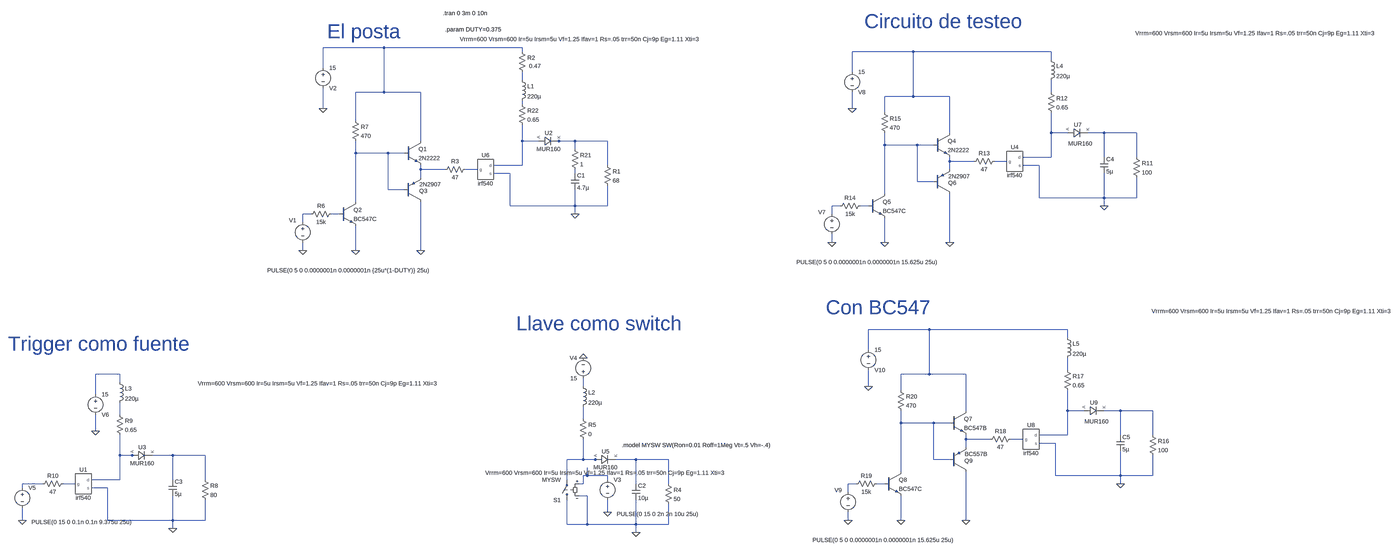
[diagram p0: schematic boostSch.asc, whole sheet]
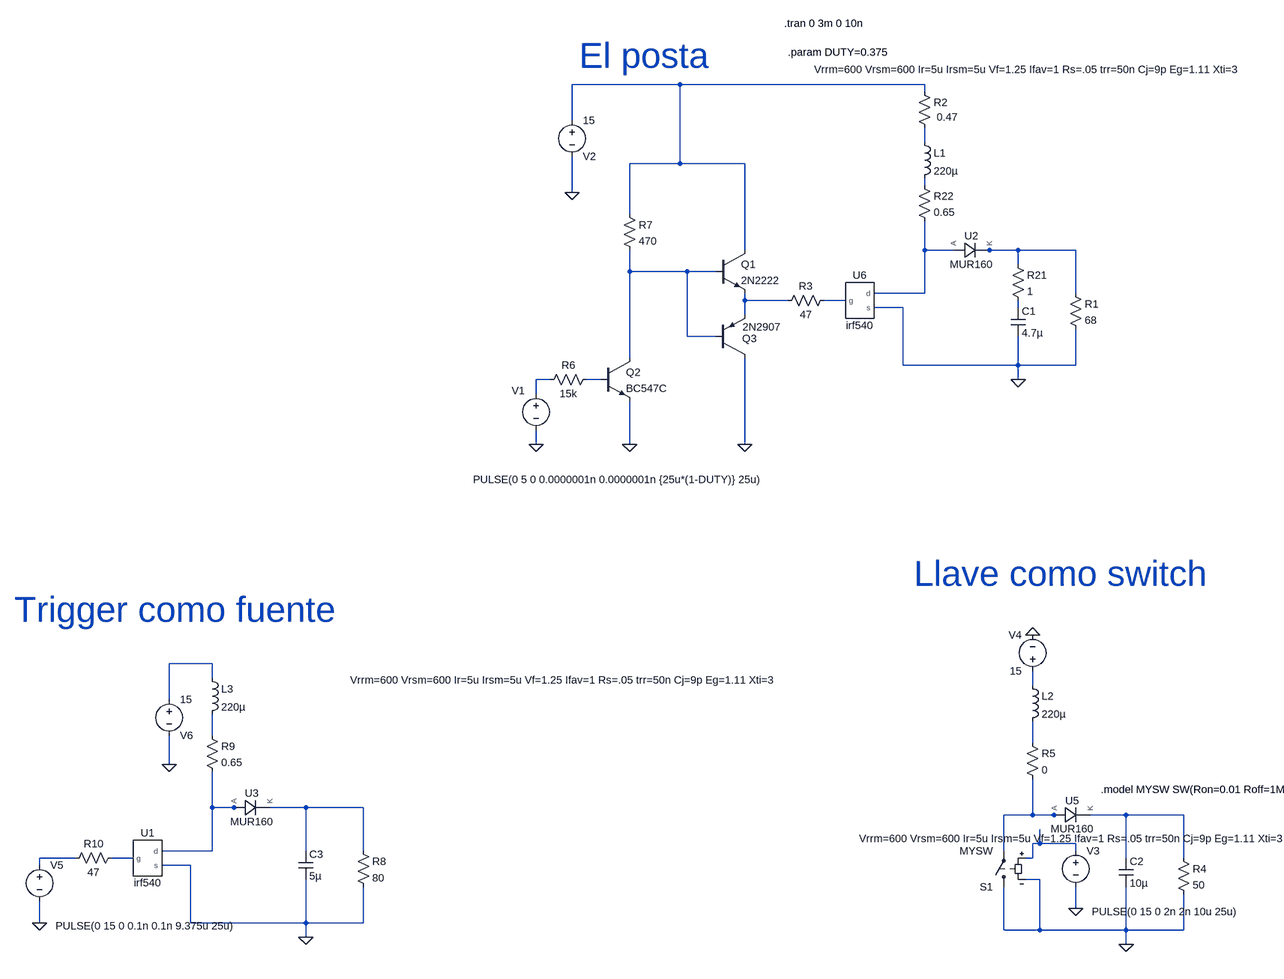
[diagram p1: schematic boostSch.asc, part, row 1 of 1, column 1 of 2]
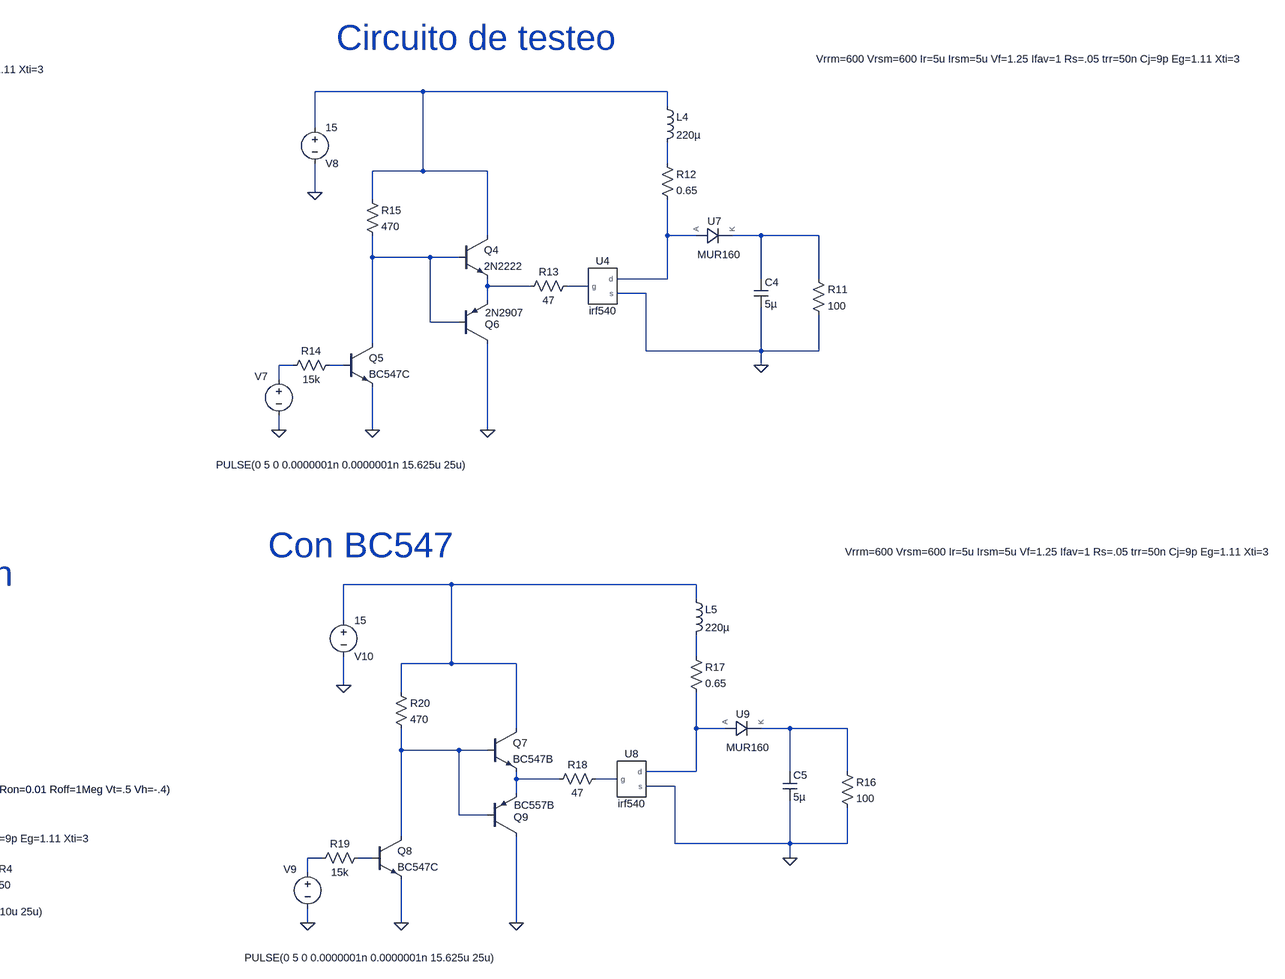
[diagram p2: schematic boostSch.asc, part, row 1 of 1, column 2 of 2]
boostSch.asc, the LTspice schematic file:
Version 4
SHEET 1 4548 1984
WIRE -976 -224 -1216 -224
WIRE -432 -224 -976 -224
WIRE -432 -208 -432 -224
WIRE 1472 -208 1232 -208
WIRE 2016 -208 1472 -208
WIRE 2016 -176 2016 -208
WIRE -1216 -144 -1216 -224
WIRE 1232 -128 1232 -208
WIRE -432 -96 -432 -128
WIRE -976 -48 -976 -224
WIRE -976 -48 -1088 -48
WIRE -832 -48 -976 -48
WIRE 2016 -48 2016 -96
WIRE 1472 -32 1472 -208
WIRE 1472 -32 1360 -32
WIRE 1616 -32 1472 -32
WIRE -432 0 -432 -16
WIRE -1216 16 -1216 -64
WIRE 1232 16 1232 -48
WIRE 1360 32 1360 -32
WIRE -1088 64 -1088 -48
WIRE 1616 112 1616 -32
WIRE 2016 112 2016 32
WIRE 2080 112 2016 112
WIRE 2224 112 2160 112
WIRE 2352 112 2224 112
WIRE -832 144 -832 -48
WIRE -432 144 -432 80
WIRE -368 144 -432 144
WIRE -288 144 -304 144
WIRE -224 144 -288 144
WIRE -96 144 -224 144
WIRE 1360 160 1360 112
WIRE 1488 160 1360 160
WIRE 1552 160 1488 160
WIRE -224 176 -224 144
WIRE -1088 192 -1088 144
WIRE -960 192 -1088 192
WIRE -896 192 -960 192
WIRE 2016 208 2016 112
WIRE 2016 208 1904 208
WIRE 2224 208 2224 112
WIRE 2352 208 2352 112
WIRE 1616 224 1616 208
WIRE 1712 224 1616 224
WIRE 1840 224 1792 224
WIRE -432 240 -432 144
WIRE -432 240 -544 240
WIRE -96 240 -96 144
WIRE 1968 240 1904 240
WIRE -832 256 -832 240
WIRE -736 256 -832 256
WIRE -608 256 -656 256
WIRE 1616 256 1616 224
WIRE -480 272 -544 272
WIRE -224 272 -224 256
WIRE -832 288 -832 256
WIRE 1488 304 1488 160
WIRE 1552 304 1488 304
WIRE -960 336 -960 192
WIRE -896 336 -960 336
WIRE 1360 352 1360 160
WIRE 1968 368 1968 240
WIRE 2224 368 2224 272
WIRE 2224 368 1968 368
WIRE 2352 368 2352 288
WIRE 2352 368 2224 368
WIRE -1088 384 -1088 192
WIRE -480 400 -480 272
WIRE -224 400 -224 336
WIRE -224 400 -480 400
WIRE -96 400 -96 320
WIRE -96 400 -224 400
WIRE 1184 400 1152 400
WIRE 1296 400 1264 400
WIRE 2224 400 2224 368
WIRE -1264 432 -1296 432
WIRE -1152 432 -1184 432
WIRE -224 432 -224 400
WIRE 1152 432 1152 400
WIRE -1296 464 -1296 432
WIRE 1152 544 1152 512
WIRE 1360 544 1360 448
WIRE 1616 544 1616 352
WIRE -1296 576 -1296 544
WIRE -1088 576 -1088 480
WIRE -832 576 -832 384
WIRE 1536 1136 1296 1136
WIRE 2080 1136 1536 1136
WIRE 2080 1168 2080 1136
WIRE 1296 1216 1296 1136
WIRE 2080 1296 2080 1248
WIRE -2016 1312 -2112 1312
WIRE 1536 1312 1536 1136
WIRE 1536 1312 1424 1312
WIRE 1680 1312 1536 1312
WIRE -2016 1344 -2016 1312
WIRE -192 1360 -192 1328
WIRE 1296 1360 1296 1296
WIRE 1424 1376 1424 1312
WIRE -2112 1392 -2112 1312
WIRE 1680 1456 1680 1312
WIRE 2080 1456 2080 1376
WIRE 2144 1456 2080 1456
WIRE 2288 1456 2224 1456
WIRE 2416 1456 2288 1456
WIRE -2016 1472 -2016 1424
WIRE -192 1488 -192 1440
WIRE 1424 1504 1424 1456
WIRE 1552 1504 1424 1504
WIRE 1616 1504 1552 1504
WIRE -2112 1536 -2112 1472
WIRE 2080 1552 2080 1456
WIRE 2080 1552 1968 1552
WIRE 2288 1552 2288 1456
WIRE 2416 1552 2416 1456
WIRE 1680 1568 1680 1552
WIRE 1776 1568 1680 1568
WIRE 1904 1568 1856 1568
WIRE 2032 1584 1968 1584
WIRE 1680 1600 1680 1568
WIRE -2016 1632 -2016 1552
WIRE -1968 1632 -2016 1632
WIRE -1952 1632 -1968 1632
WIRE -1808 1632 -1888 1632
WIRE -1680 1632 -1808 1632
WIRE -192 1648 -192 1568
WIRE -192 1648 -256 1648
WIRE -144 1648 -192 1648
WIRE -128 1648 -144 1648
WIRE 16 1648 -64 1648
WIRE 144 1648 16 1648
WIRE 1552 1648 1552 1504
WIRE 1616 1648 1552 1648
WIRE 1424 1696 1424 1504
WIRE -176 1712 -176 1680
WIRE -176 1712 -192 1712
WIRE -96 1712 -176 1712
WIRE 2032 1712 2032 1584
WIRE 2288 1712 2288 1616
WIRE 2288 1712 2032 1712
WIRE 2416 1712 2416 1632
WIRE 2416 1712 2288 1712
WIRE -2016 1728 -2016 1632
WIRE -2016 1728 -2128 1728
WIRE -1808 1728 -1808 1632
WIRE -1680 1728 -1680 1632
WIRE -256 1728 -256 1648
WIRE -96 1728 -96 1712
WIRE -2320 1744 -2400 1744
WIRE -2192 1744 -2240 1744
WIRE -192 1744 -192 1712
WIRE -192 1744 -208 1744
WIRE 16 1744 16 1648
WIRE 144 1744 144 1648
WIRE 1248 1744 1216 1744
WIRE 1360 1744 1328 1744
WIRE 2288 1744 2288 1712
WIRE -2400 1760 -2400 1744
WIRE -2064 1760 -2128 1760
WIRE 1216 1776 1216 1744
WIRE -176 1792 -208 1792
WIRE -96 1856 -96 1808
WIRE -2400 1888 -2400 1840
WIRE -2064 1888 -2064 1760
WIRE -1808 1888 -1808 1792
WIRE -1808 1888 -2064 1888
WIRE -1680 1888 -1680 1808
WIRE -1680 1888 -1808 1888
WIRE 1216 1888 1216 1856
WIRE 1424 1888 1424 1792
WIRE 1680 1888 1680 1696
WIRE -256 1904 -256 1808
WIRE -176 1904 -176 1792
WIRE -176 1904 -256 1904
WIRE 16 1904 16 1808
WIRE 16 1904 -176 1904
WIRE 144 1904 144 1824
WIRE 144 1904 16 1904
WIRE -1808 1920 -1808 1888
WIRE 16 1936 16 1904
FLAG -1296 576 0
FLAG -1216 16 0
FLAG -224 432 0
FLAG -192 1248 0
FLAG 16 1936 0
FLAG -96 1856 0
FLAG -1088 576 0
FLAG -832 576 0
FLAG -2112 1536 0
FLAG -1808 1920 0
FLAG -2400 1888 0
FLAG 1152 544 0
FLAG 1232 16 0
FLAG 2224 400 0
FLAG 1360 544 0
FLAG 1616 544 0
FLAG 1216 1888 0
FLAG 1296 1360 0
FLAG 2288 1744 0
FLAG 1424 1888 0
FLAG 1680 1888 0
SYMBOL cap -240 272 R0
SYMATTR InstName C1
SYMATTR Value 4.7µ
SYMBOL res -112 224 R0
SYMATTR InstName R1
SYMATTR Value 68
SYMBOL res -448 -224 R0
WINDOW 3 43 72 Left 2
SYMATTR Value 0.47
SYMATTR InstName R2
SYMBOL ind -448 -112 R0
SYMATTR InstName L1
SYMATTR Value 220µ
SYMBOL voltage -1296 448 R0
WINDOW 0 -54 9 Left 2
WINDOW 3 -140 206 Left 2
WINDOW 123 0 0 Left 0
WINDOW 39 0 0 Left 0
SYMATTR InstName V1
SYMATTR Value PULSE(0 5 0 0.0000001n 0.0000001n {25u*(1-DUTY)} 25u)
SYMBOL voltage -1216 -160 R0
WINDOW 0 24 96 Left 2
WINDOW 3 24 16 Left 2
WINDOW 123 0 0 Left 0
WINDOW 39 0 0 Left 0
SYMATTR InstName V2
SYMATTR Value 15
SYMBOL res -640 240 R90
WINDOW 0 0 56 VBottom 2
WINDOW 3 32 56 VTop 2
SYMATTR InstName R3
SYMATTR Value 47
SYMBOL cap 0 1744 R0
SYMATTR InstName C2
SYMATTR Value 10µ
SYMBOL res 128 1728 R0
SYMATTR InstName R4
SYMATTR Value 50
SYMBOL res -208 1472 R0
SYMATTR InstName R5
SYMATTR Value 0
SYMBOL ind -208 1344 R0
SYMATTR InstName L2
SYMATTR Value 220µ
SYMBOL voltage -96 1712 R0
WINDOW 3 36 151 Left 2
WINDOW 123 0 0 Left 0
WINDOW 39 0 0 Left 0
SYMATTR Value PULSE(0 15 0 2n 2n 10u 25u)
SYMATTR InstName V3
SYMBOL voltage -192 1344 R180
WINDOW 0 24 96 Left 2
WINDOW 3 24 16 Left 2
WINDOW 123 0 0 Left 0
WINDOW 39 0 0 Left 0
SYMATTR InstName V4
SYMATTR Value 15
SYMBOL sw -256 1824 R180
SYMATTR InstName S1
SYMATTR Value MYSW
SYMBOL npn -896 144 R0
SYMATTR InstName Q1
SYMATTR Value 2N2222
SYMBOL npn -1152 384 R0
SYMATTR InstName Q2
SYMATTR Value BC547C
SYMBOL res -1168 416 R90
WINDOW 0 0 56 VBottom 2
WINDOW 3 32 56 VTop 2
SYMATTR InstName R6
SYMATTR Value 15k
SYMBOL res -1104 48 R0
SYMATTR InstName R7
SYMATTR Value 470
SYMBOL pnp -896 384 M180
WINDOW 0 58 43 Left 2
WINDOW 3 59 69 Left 2
SYMATTR InstName Q3
SYMATTR Value 2N2907
SYMBOL cap -1824 1728 R0
SYMATTR InstName C3
SYMATTR Value 5µ
SYMBOL res -1696 1712 R0
SYMATTR InstName R8
SYMATTR Value 80
SYMBOL res -2032 1456 R0
SYMATTR InstName R9
SYMATTR Value 0.65
SYMBOL ind -2032 1328 R0
SYMATTR InstName L3
SYMATTR Value 220µ
SYMBOL voltage -2112 1376 R0
WINDOW 0 24 96 Left 2
WINDOW 3 24 16 Left 2
WINDOW 123 0 0 Left 0
WINDOW 39 0 0 Left 0
SYMATTR InstName V6
SYMATTR Value 15
SYMBOL res -2224 1728 R90
WINDOW 0 0 56 VBottom 2
WINDOW 3 32 56 VTop 2
SYMATTR InstName R10
SYMATTR Value 47
SYMBOL voltage -2400 1744 R0
WINDOW 3 36 151 Left 2
WINDOW 123 0 0 Left 0
WINDOW 39 0 0 Left 0
SYMATTR Value PULSE(0 15 0 0.1n 0.1n 9.375u 25u)
SYMATTR InstName V5
SYMBOL mur160 -1936 1632 R90
WINDOW 0 -16 -8 VBottom 2
WINDOW 3 16 -8 VTop 2
WINDOW 39 -299 -700 VTop 2
SYMATTR InstName U3
SYMBOL mur160 -112 1648 R90
WINDOW 0 -16 -8 VBottom 2
WINDOW 3 16 -8 VTop 2
WINDOW 39 37 -8 VTop 2
SYMATTR InstName U5
SYMBOL irf540_V2 -576 256 R0
SYMATTR InstName U6
SYMBOL irf540_V2 -2160 1744 R0
SYMATTR InstName U1
SYMBOL mur160 -336 144 R90
WINDOW 0 -16 -8 VBottom 2
WINDOW 3 16 -8 VTop 2
WINDOW 39 -417 -132 VTop 2
SYMATTR InstName U2
SYMBOL cap 2208 208 R0
SYMATTR InstName C4
SYMATTR Value 5µ
SYMBOL res 2336 192 R0
SYMATTR InstName R11
SYMATTR Value 100
SYMBOL res 2000 -64 R0
SYMATTR InstName R12
SYMATTR Value 0.65
SYMBOL ind 2000 -192 R0
SYMATTR InstName L4
SYMATTR Value 220µ
SYMBOL voltage 1152 416 R0
WINDOW 0 -54 9 Left 2
WINDOW 3 -140 206 Left 2
WINDOW 123 0 0 Left 0
WINDOW 39 0 0 Left 0
SYMATTR InstName V7
SYMATTR Value PULSE(0 5 0 0.0000001n 0.0000001n 15.625u 25u)
SYMBOL voltage 1232 -144 R0
WINDOW 0 24 96 Left 2
WINDOW 3 24 16 Left 2
WINDOW 123 0 0 Left 0
WINDOW 39 0 0 Left 0
SYMATTR InstName V8
SYMATTR Value 15
SYMBOL res 1808 208 R90
WINDOW 0 0 56 VBottom 2
WINDOW 3 32 56 VTop 2
SYMATTR InstName R13
SYMATTR Value 47
SYMBOL npn 1552 112 R0
SYMATTR InstName Q4
SYMATTR Value 2N2222
SYMBOL npn 1296 352 R0
SYMATTR InstName Q5
SYMATTR Value BC547C
SYMBOL res 1280 384 R90
WINDOW 0 0 56 VBottom 2
WINDOW 3 32 56 VTop 2
SYMATTR InstName R14
SYMATTR Value 15k
SYMBOL res 1344 16 R0
SYMATTR InstName R15
SYMATTR Value 470
SYMBOL pnp 1552 352 M180
WINDOW 0 58 43 Left 2
WINDOW 3 59 69 Left 2
SYMATTR InstName Q6
SYMATTR Value 2N2907
SYMBOL irf540_V2 1872 224 R0
SYMATTR InstName U4
SYMBOL mur160 2112 112 R90
WINDOW 0 -16 -8 VBottom 2
WINDOW 3 27 -18 VTop 2
WINDOW 39 -408 -708 VTop 2
SYMATTR InstName U7
SYMBOL cap 2272 1552 R0
SYMATTR InstName C5
SYMATTR Value 5µ
SYMBOL res 2400 1536 R0
SYMATTR InstName R16
SYMATTR Value 100
SYMBOL res 2064 1280 R0
SYMATTR InstName R17
SYMATTR Value 0.65
SYMBOL ind 2064 1152 R0
SYMATTR InstName L5
SYMATTR Value 220µ
SYMBOL voltage 1216 1760 R0
WINDOW 0 -54 9 Left 2
WINDOW 3 -140 206 Left 2
WINDOW 123 0 0 Left 0
WINDOW 39 0 0 Left 0
SYMATTR InstName V9
SYMATTR Value PULSE(0 5 0 0.0000001n 0.0000001n 15.625u 25u)
SYMBOL voltage 1296 1200 R0
WINDOW 0 24 96 Left 2
WINDOW 3 24 16 Left 2
WINDOW 123 0 0 Left 0
WINDOW 39 0 0 Left 0
SYMATTR InstName V10
SYMATTR Value 15
SYMBOL res 1872 1552 R90
WINDOW 0 0 56 VBottom 2
WINDOW 3 32 56 VTop 2
SYMATTR InstName R18
SYMATTR Value 47
SYMBOL npn 1616 1456 R0
SYMATTR InstName Q7
SYMATTR Value BC547B
SYMBOL npn 1360 1696 R0
SYMATTR InstName Q8
SYMATTR Value BC547C
SYMBOL res 1344 1728 R90
WINDOW 0 0 56 VBottom 2
WINDOW 3 32 56 VTop 2
SYMATTR InstName R19
SYMATTR Value 15k
SYMBOL res 1408 1360 R0
SYMATTR InstName R20
SYMATTR Value 470
SYMBOL pnp 1616 1696 M180
WINDOW 0 58 43 Left 2
WINDOW 3 59 69 Left 2
SYMATTR InstName Q9
SYMATTR Value BC557B
SYMBOL irf540_V2 1936 1568 R0
SYMATTR InstName U8
SYMBOL mur160 2176 1456 R90
WINDOW 0 -16 -8 VBottom 2
WINDOW 3 27 -18 VTop 2
WINDOW 39 -408 -708 VTop 2
SYMATTR InstName U9
SYMBOL res -240 160 R0
SYMATTR InstName R21
SYMATTR Value 1
SYMBOL res -448 -16 R0
SYMATTR InstName R22
SYMATTR Value 0.65
TEXT -744 -360 Left 2 !.tran 0 3m 0 10n
TEXT -40 1592 Left 2 !.model MYSW SW(Ron=0.01 Roff=1Meg Vt=.5 Vh=-.4)
TEXT 1128 1048 Left 6 ;Con BC547
TEXT -1200 -288 Left 6 ;El posta
TEXT -2456 1192 Left 6 ;Trigger como fuente
TEXT -456 1112 Left 6 ;Llave como switch
TEXT 1280 -328 Left 6 ;Circuito de testeo
TEXT -736 -296 Left 2 !.param DUTY=0.375

The netlist it stands for:
* boostSch.asc
C1 N016 0 4.7µ
R1 N009 0 68
R2 N001 N003 0.47
L1 N003 N005 220µ
V1 N019 0 PULSE(0 5 0 0.0000001n 0.0000001n {25u*(1-DUTY)} 25u)
V2 N001 0 15
R3 N015 N014 47
C2 N035 0 10µ
R4 N035 0 50
R5 N028 N034 0
L2 N024 N028 220µ
V3 N036 0 PULSE(0 15 0 2n 2n 10u 25u)
V4 N024 0 15
S1 0 N034 N036 0 MYSW
Q1 N001 N011 N014 0 2N2222
Q2 N011 N020 0 0 BC547C
R6 N020 N019 15k
R7 N001 N011 470
Q3 0 N011 N014 0 2N2907
C3 N033 0 5µ
R8 N033 0 80
R9 N027 N032 0.65
L3 N023 N027 220µ
V6 N023 0 15
R10 N038 N037 47
V5 N037 0 PULSE(0 15 0 0.1n 0.1n 9.375u 25u)
XU3 N032 N033 MUR160 Vrrm=600 Vrsm=600 Ir=5u Irsm=5u Vf=1.25 Ifav=1 Rs=.05 trr=50n Cj=9p Eg=1.11 Xti=3  ; pins A K
XU5 N034 N035 MUR160 Vrrm=600 Vrsm=600 Ir=5u Irsm=5u Vf=1.25 Ifav=1 Rs=.05 trr=50n Cj=9p Eg=1.11 Xti=3  ; pins A K
XU6 N008 N015 0 irf540  ; pins d g s
XU1 N032 N038 0 irf540  ; pins d g s
XU2 N008 N009 MUR160 Vrrm=600 Vrsm=600 Ir=5u Irsm=5u Vf=1.25 Ifav=1 Rs=.05 trr=50n Cj=9p Eg=1.11 Xti=3  ; pins A K
C4 N007 0 5µ
R11 N007 0 100
R12 N004 N006 0.65
L4 N002 N004 220µ
V7 N017 0 PULSE(0 5 0 0.0000001n 0.0000001n 15.625u 25u)
V8 N002 0 15
R13 N013 N012 47
Q4 N002 N010 N012 0 2N2222
Q5 N010 N018 0 0 BC547C
R14 N018 N017 15k
R15 N002 N010 470
Q6 0 N010 N012 0 2N2907
XU4 N006 N013 0 irf540  ; pins d g s
XU7 N006 N007 MUR160 Vrrm=600 Vrsm=600 Ir=5u Irsm=5u Vf=1.25 Ifav=1 Rs=.05 trr=50n Cj=9p Eg=1.11 Xti=3  ; pins A K
C5 N026 0 5µ
R16 N026 0 100
R17 N022 N025 0.65
L5 N021 N022 220µ
V9 N039 0 PULSE(0 5 0 0.0000001n 0.0000001n 15.625u 25u)
V10 N021 0 15
R18 N031 N030 47
Q7 N021 N029 N030 0 BC547B
Q8 N029 N040 0 0 BC547C
R19 N040 N039 15k
R20 N021 N029 470
Q9 0 N029 N030 0 BC557B
XU8 N025 N031 0 irf540  ; pins d g s
XU9 N025 N026 MUR160 Vrrm=600 Vrsm=600 Ir=5u Irsm=5u Vf=1.25 Ifav=1 Rs=.05 trr=50n Cj=9p Eg=1.11 Xti=3  ; pins A K
R21 N009 N016 1
R22 N005 N008 0.65
.model NPN NPN
.model PNP PNP
.lib standard.bjt
.tran 0 3m 0 10n
.model MYSW SW(Ron=0.01 Roff=1Meg Vt=.5 Vh=-.4)
* Con BC547
* El posta
* Trigger como fuente
* Llave como switch
* Circuito de testeo
.param DUTY=0.375
.lib Libraries\mur160_spice.lib
.lib Libraries\sihf540.lib
.backanno
.end